# Altium project BoxCaptureZone_Hardware_V1_0_0.PrjPcb
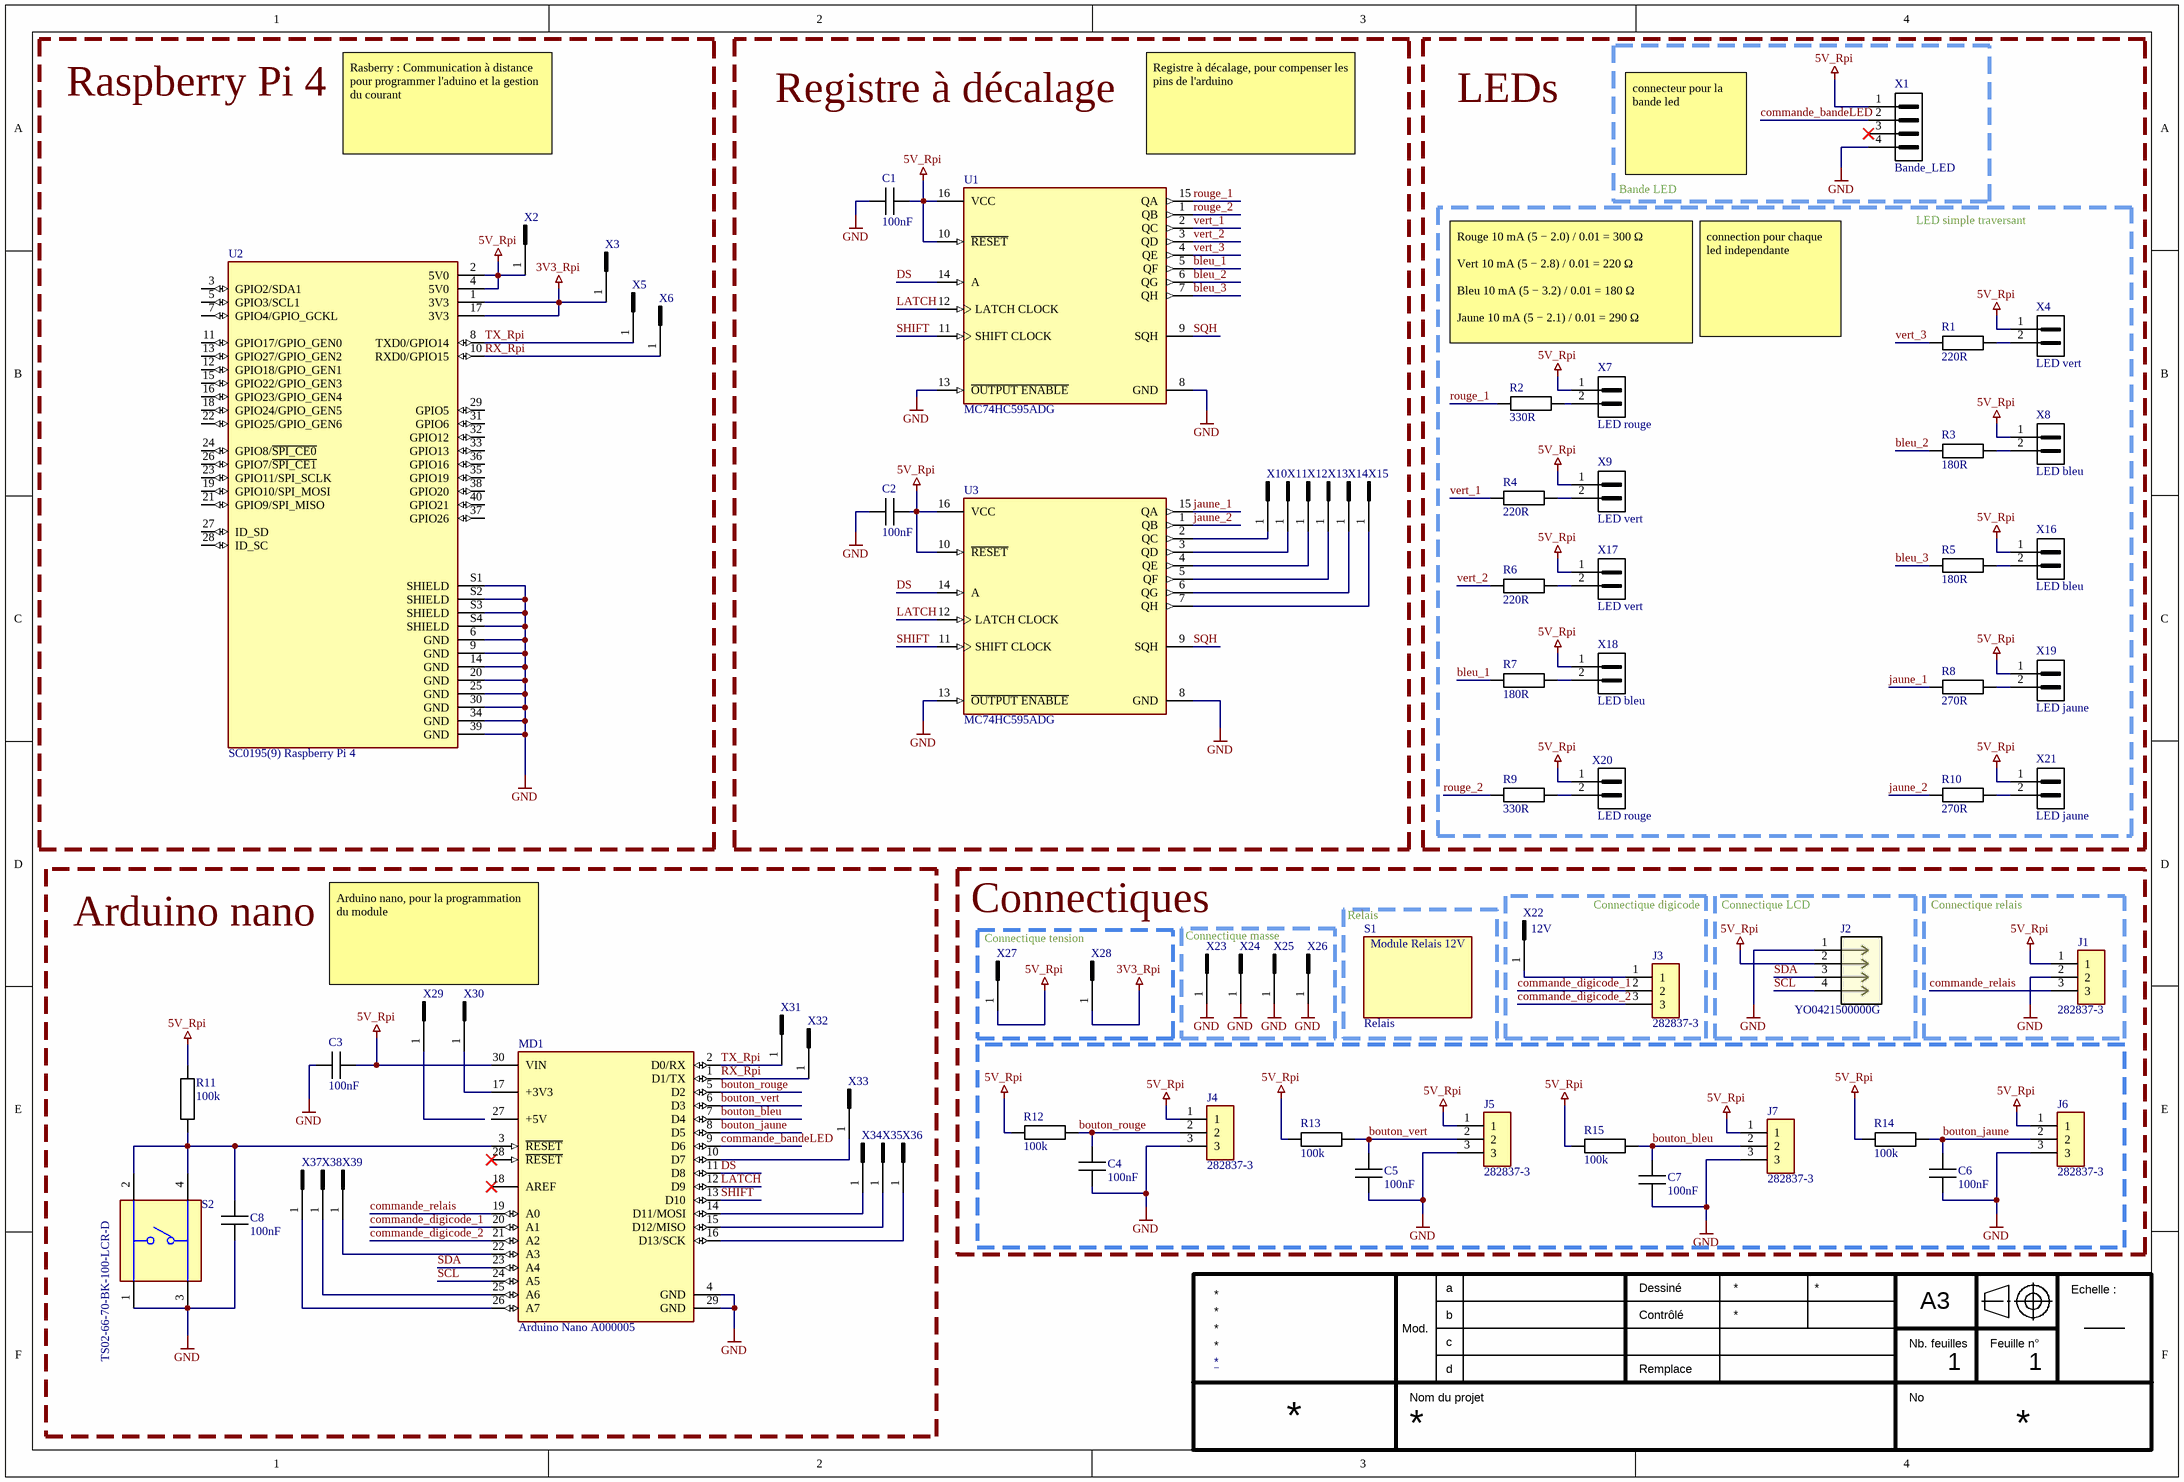
[diagram p0: ArduinoUno_Rpi.SchDoc]
1 sheet, 75 parts. Net scope: global (net labels, ports and power ports of the same name join across sheets).
Board file: PCB1.PcbDoc

## Sheet ArduinoUno_Rpi.SchDoc
size 408 x 276 mm; SheetNumber: 1; SheetTotal: 1

### Parts
C1  100nF  [CAPC2012X08M]
C2  100nF  [CAPC2012X08M]
C3  100nF  [CAPC2012X08M]
C4  100nF  [CAPC2012X08M]
C5  100nF  [CAPC2012X08M]
C6  100nF  [CAPC2012X08M]
C7  100nF  [CAPC2012X08M]
C8  100nF  [CAPC2012X08M]
J1  282837-3  [TE_282837-3]
J2  YO0421500000G  [CONN4_500000G_AMP]
J3  282837-3  [TE_282837-3]
J4  282837-3  [TE_282837-3]
J5  282837-3  [TE_282837-3]
J6  282837-3  [TE_282837-3]
J7  282837-3  [TE_282837-3]
MD1  Arduino Nano A000005  [FP-A000005-MFG]
R1  220R  [RESC1608X06M]
R2  330R  [RESC1608X06M]
R3  180R  [RESC1608X06M]
R4  220R  [RESC1608X06M]
R5  180R  [RESC1608X06M]
R6  220R  [RESC1608X06M]
R7  180R  [RESC1608X06M]
R8  270R  [RESC1608X06M]
R9  330R  [RESC1608X06M]
R10  270R  [RESC1608X06M]
R11  100k  [RESC2012X06M]
R12  100k  [RESC2012X06M]
R13  100k  [RESC2012X06M]
R14  100k  [RESC2012X06M]
R15  100k  [RESC2012X06M]
S1  Relais  [BOOSTER12V]
S2  TS02-66-70-BK-100-LCR-D  [SW_TS02-66-70-BK-100-LCR-D]
U1  MC74HC595ADG  [FP-751B-05-MFG]
U2  SC0195(9) Raspberry Pi 4  [MODULE_SC0195(9)]
U3  MC74HC595ADG  [FP-751B-05-MFG]
X1  Bande_LED  [PIN-1x04-2.54]
X2  2.54  [PIN-1x01-2.54]  (value not drawn)
X3  2.54  [PIN-1x01-2.54]  (value not drawn)
X4  LED vert  [PIN-1x02-2.54]
X5  2.54  [PIN-1x01-2.54]  (value not drawn)
X6  2.54  [PIN-1x01-2.54]  (value not drawn)
X7  LED rouge  [PIN-1x02-2.54]
X8  LED bleu  [PIN-1x02-2.54]
X9  LED vert  [PIN-1x02-2.54]
X10  2.54  [PIN-1x01-2.54]  (value not drawn)
X11  2.54  [PIN-1x01-2.54]  (value not drawn)
X12  2.54  [PIN-1x01-2.54]  (value not drawn)
X13  2.54  [PIN-1x01-2.54]  (value not drawn)
X14  2.54  [PIN-1x01-2.54]  (value not drawn)
X15  2.54  [PIN-1x01-2.54]  (value not drawn)
X16  LED bleu  [PIN-1x02-2.54]
X17  LED vert  [PIN-1x02-2.54]
X18  LED bleu  [PIN-1x02-2.54]
X19  LED jaune  [PIN-1x02-2.54]
X20  LED rouge  [PIN-1x02-2.54]
X21  LED jaune  [PIN-1x02-2.54]
X22  12V  [PIN-1x01-2.54]
X23  2.54  [PIN-1x01-2.54]  (value not drawn)
X24  2.54  [PIN-1x01-2.54]  (value not drawn)
X25  2.54  [PIN-1x01-2.54]  (value not drawn)
X26  2.54  [PIN-1x01-2.54]  (value not drawn)
X27  2.54  [PIN-1x01-2.54]  (value not drawn)
X28  2.54  [PIN-1x01-2.54]  (value not drawn)
X29  2.54  [PIN-1x01-2.54]  (value not drawn)
X30  2.54  [PIN-1x01-2.54]  (value not drawn)
X31  2.54  [PIN-1x01-2.54]  (value not drawn)
X32  2.54  [PIN-1x01-2.54]  (value not drawn)
X33  2.54  [PIN-1x01-2.54]  (value not drawn)
X34  2.54  [PIN-1x01-2.54]  (value not drawn)
X35  2.54  [PIN-1x01-2.54]  (value not drawn)
X36  2.54  [PIN-1x01-2.54]  (value not drawn)
X37  2.54  [PIN-1x01-2.54]  (value not drawn)
X38  2.54  [PIN-1x01-2.54]  (value not drawn)
X39  2.54  [PIN-1x01-2.54]  (value not drawn)

### Blocks framed on the sheet
Raspberry Pi 4: U2 X2 X3 X5 X6
Registre à décalage: C1 C2 U1 U3 X10-X15
Bande LED: X1
LED simple traversant: R1-R10 X4 X7-X9 X16-X21
Arduino nano: C3 C8 MD1 R11 S2 X29-X39
Connectiques: C4-C7 J4-J7 R12-R15
Connectique digicode: J3 X22
Connectique LCD: J2
Connectique relais: J1
Connectique tension: X27 X28
Connectique masse: X23-X26
Relais: S1

### Nets
3V3_Rpi: U2.1(3V3) U2.17(3V3) X3.1 X28.1
5V_Rpi: C1.1 C2.1 C3.1 J1.1 J2.2 J4.1 J5.1 J6.1 J7.1 MD1.30(VIN) R11.2 R12.2 R13.2 R14.2 R15.2 U1.10(~{RESET}) U1.16(VCC) U2.2(5V0) U2.4(5V0) U3.10(~{RESET}) U3.16(VCC) X1.1 X2.1 X4.1 X7.1 X8.1 X9.1 X16.1 X17.1 X18.1 X19.1 X20.1 X21.1 X27.1
GND: C1.2 C2.2 C3.2 C4.1 C5.1 C6.1 C7.1 C8.1 J1.2 J2.1 J4.3 J5.3 J6.3 J7.3 MD1.4(GND) MD1.29(GND) S2.1 S2.3 U1.8(GND) U1.13(~{OUTPUT_ENABLE}) U2.6(GND) U2.9(GND) U2.14(GND) U2.20(GND) U2.25(GND) U2.30(GND) U2.34(GND) U2.39(GND) U2.S1(SHIELD) U2.S2(SHIELD) U2.S3(SHIELD) U2.S4(SHIELD) U3.8(GND) U3.13(~{OUTPUT_ENABLE}) X1.4 X23.1 X24.1 X25.1 X26.1
bleu_1: R7.1 U1.5(QF)
bleu_2: R3.1 U1.6(QG)
bleu_3: R5.1 U1.7(QH)
bouton_bleu: C7.2 J7.2 MD1.7(D4) R15.1
bouton_jaune: C6.2 J6.2 MD1.8(D5) R14.1
bouton_rouge: C4.2 J4.2 MD1.5(D2) R12.1
bouton_vert: C5.2 J5.2 MD1.6(D3) R13.1
commande_bandeLED: MD1.9(D6) X1.2
commande_digicode_1: J3.2 MD1.20(A1)
commande_digicode_2: J3.3 MD1.21(A2)
commande_relais: J1.3 MD1.19(A0)
DS: MD1.11(D8) U1.14(A) U3.14(A)
jaune_1: R8.1 U3.15(QA)
jaune_2: R10.1 U3.1(QB)
LATCH: MD1.12(D9) U1.12(LATCH_CLOCK) U3.12(LATCH_CLOCK)
rouge_1: R2.1 U1.15(QA)
rouge_2: R9.1 U1.1(QB)
RX_Rpi: MD1.1(D1/TX) U2.10(RXD0/GPIO15) X6.1 X32.1
SCL: J2.4 MD1.24(A5)
SDA: J2.3 MD1.23(A4)
SHIFT: MD1.13(D10) U1.11(SHIFT_CLOCK) U3.11(SHIFT_CLOCK)
SQH: U1.9(SQH) U3.9(SQH)
TX_Rpi: MD1.2(D0/RX) U2.8(TXD0/GPIO14) X5.1 X31.1
vert_1: R4.1 U1.2(QC)
vert_2: R6.1 U1.3(QD)
vert_3: R1.1 U1.4(QE)
NetC8_2: C8.2 MD1.3(~{RESET}) R11.1 S2.2 S2.4
NetJ3_1: J3.1 X22.1
NetMD1_10: MD1.10(D7) X33.1
NetMD1_14: MD1.14(D11/MOSI) X34.1
NetMD1_15: MD1.15(D12/MISO) X35.1
NetMD1_16: MD1.16(D13/SCK) X36.1
NetMD1_17: MD1.17(+3V3) X30.1
NetMD1_22: MD1.22(A3) X39.1
NetMD1_25: MD1.25(A6) X38.1
NetMD1_26: MD1.26(A7) X37.1
NetR1_2: R1.2 X4.2
NetR2_2: R2.2 X7.2
NetR3_2: R3.2 X8.2
NetR4_2: R4.2 X9.2
NetR5_2: R5.2 X16.2
NetR6_2: R6.2 X17.2
NetR7_2: R7.2 X18.2
NetR8_2: R8.2 X19.2
NetR9_2: R9.2 X20.2
NetR10_2: R10.2 X21.2
NetU3_2: U3.2(QC) X10.1
NetU3_3: U3.3(QD) X11.1
NetU3_4: U3.4(QE) X12.1
NetU3_5: U3.5(QF) X13.1
NetU3_6: U3.6(QG) X14.1
NetU3_7: U3.7(QH) X15.1

Not connected (* = marked no-connect by the designer): MD1 18(AREF)* 27(+5V) 28(~{RESET})*; U2 3(GPIO2/SDA1) 5(GPIO3/SCL1) 7(GPIO4/GPIO_GCKL) 11(GPIO17/GPIO_GEN0) 12(GPIO18/GPIO_GEN1) 13(GPIO27/GPIO_GEN2) 15(GPIO22/GPIO_GEN3) 16(GPIO23/GPIO_GEN4) 18(GPIO24/GPIO_GEN5) 19(GPIO10/SPI_MOSI) 21(GPIO9/SPI_MISO) 22(GPIO25/GPIO_GEN6) 23(GPIO11/SPI_SCLK) 24(GPIO8/~{SPI_CE0}) 26(GPIO7/~{SPI_CE1}) 27(ID_SD) 28(ID_SC) 29(GPIO5) 31(GPIO6) 32(GPIO12) 33(GPIO13) 35(GPIO19) 36(GPIO16) 37(GPIO26) 38(GPIO20) 40(GPIO21); X1 3*; X29 1

### Notes on the sheet
- Rasberry : Communication à distance pour programmer l'aduino et la gestion du courant
- (near U1) Registre à décalage, pour compenser les pins de l'arduino
- LEDs
- connecteur pour la bande led
- Rouge	10 mA	(5 − 2.0) / 0.01 = 300 Ω
  Vert	10 mA	(5 − 2.8) / 0.01 = 220 Ω
  Bleu	10 mA	(5 − 3.2) / 0.01 = 180 Ω
  Jaune	10 mA	(5 − 2.1) / 0.01 = 290 Ω
- connection pour chaque led independante
- Arduino nano, pour la programmation du module
- a
- Dessiné
- A3
- Echelle :
- Mod.
- b
- c
- d
- Contrôlé
- Remplace
- Nb. feuilles
- Feuille n°
- Nom du projet
- No
- (in symbol Relais) Module Relais 12V

### Library data of the parts
C1-C8 = CMP-065-000038-2: CAPC 100nF X7R 50V 10% 2012 (0805 INCH); Manufacturer Number: C2012X7R1H104K085AA; Manufacturer: TDK; IsStocked: 1; TemperatureRange: -55°C to +125°C; PN: PN-747862; Supplier Part Number 1: FAB.0805_C 100n; Supplier Price 1: 0.0200; Voltage: 50V; Dielectric: X7R; Value: 100nF; SubCategory: Condensateurs ceramique; Category: Passives; Tolerance: ±10%; Supplier 1: ETML
J1 J3-J7 = 282837-3: TERMI-BLOK PCB MOUNT 3P; Availability: Unavailable; Package: None; MP: 282837-3; Value: *; Price: None
J2 = YO0421500000G: No Description Available; Manufacturer_Name: Amphenol ICC; Copyright: Copyright (C) 2025 Ultra Librarian. All rights reserved.; Manufacturer_Part_Number: YO0421500000G; RefDes: RefDes; Type: Type
MD1 = CMP-189986-000002-1: ARDUINO NANO ATMEGA328 EVAL BRD; Number of Bits: 8; Evaluation Kit: Yes; Operating Supply Voltage: 12V; Interface: I2C; Data Bus Width: 8b; Core Architecture: AVR; Packaging: Bulk; Length: 7inch; Package Quantity: 50; Width: 5inch; REACH SVHC: No SVHC; Weight: 0.358383oz; Series: AVR® ATmega; Height: 0.25inch
R1 R4 R6 = CMP-066-000104-2: RES 220ohm  ±1% 0.1W  1608 (0603 INCH); Manufacturer Number: RC0603FR-07220RL; Manufacturer: Yageo; Voltage: 75V; Value: 220; TemperatureRange: -55°C to 155°C; PN: PN-315954; TemperatureCoeff: ±100ppm/°C; IsStocked: 1; Supplier 1: ETML; Power: 0.1W; SubCategory: Resistances couche epaisse; Supplier Price 1: 0.0200; Category: Passives; Tolerance: ±1%; Supplier Part Number 1: FAB.0603_R 220R
R2 R9 = CMP-066-000106-2: RES 330ohm  ±1% 0.1W  1608 (0603 INCH); Manufacturer: Yageo; Manufacturer Number: RC0603FR-07330RL; PN: PN-554037; Voltage: 75V; Value: 330; TemperatureRange: -55°C to 155°C; TemperatureCoeff: ±100ppm/°C; IsStocked: 1; SubCategory: Resistances couche epaisse; Tolerance: ±1%; Supplier Price 1: 0.0200; Category: Passives; Power: 0.1W; Supplier Part Number 1: FAB.0603_R 330R; Supplier 1: ETML
R3 R5 R7 = CMP-066-000103-2: RES 180ohm  ±1% 0.1W  1608 (0603 INCH); Manufacturer Number: RC0603FR-07180RL; Manufacturer: Yageo; TemperatureRange: -55°C to 155°C; PN: PN-646912; IsStocked: 1; Voltage: 75V; TemperatureCoeff: ±100ppm/°C; Value: 180; Supplier 1: ETML; Category: Passives; Supplier Price 1: 0.0200; Tolerance: ±1%; Power: 0.1W; SubCategory: Resistances couche epaisse; Supplier Part Number 1: FAB.0603_R 180R
R8 R10 = CMP-066-000105-2: RES 270ohm  ±1% 0.1W  1608 (0603 INCH); Manufacturer: Yageo; Manufacturer Number: RC0603FR-07270RL; TemperatureCoeff: ±100ppm/°C; TemperatureRange: -55°C to 155°C; Voltage: 75V; Value: 270; PN: PN-884995; IsStocked: 1; Category: Passives; Supplier Part Number 1: FAB.0603_R 270R; Tolerance: ±1%; Supplier 1: ETML; Power: 0.1W; SubCategory: Resistances couche epaisse; Supplier Price 1: 0.0200
R11-R15 = CMP-066-000211-2: RES 100kohm  ±1% 0.125W 2012 (0805 INCH); Manufacturer: Yageo; Manufacturer Number: RC0805FR-07100KL; TemperatureCoeff: ±200ppm/°C; Voltage: 150V; TemperatureRange: -55°C to 155°C; IsStocked: 1; PN: PN-903408; Category: Passives; Supplier Part Number 1: FAB.0805_R 100k; Value: 100k; Tolerance: ±1%; Supplier Price 1: 0.0200; Power: 0.125W; SubCategory: Resistances couche epaisse; Supplier 1: ETML
S1 = Relais: 6 x 6 mm, 7 mm Actuator Height, 100 gf, Black, Long Crimped, Through Hole, SPST, Tactile Switch; MF: Same Sky; MP: TS02-66-70-BK-100-LCR-D; SnapEDA_Link: https://www.snapeda.com/parts/TS02-66-70-BK-100-LCR-D/Same+Sky/view-part/?ref=snap; Package: None; Value: *; Check_prices: https://www.snapeda.com/parts/TS02-66-70-BK-100-LCR-D/Same+Sky/view-part/?ref=eda
S2 = TS02-66-70-BK-100-LCR-D: 6 x 6 mm, 7 mm Actuator Height, 100 gf, Black, Long Crimped, Through Hole, SPST, Tactile Switch; MF: Same Sky; SnapEDA_Link: https://www.snapeda.com/parts/TS02-66-70-BK-100-LCR-D/Same+Sky/view-part/?ref=snap; Package: None; Value: *; MP: TS02-66-70-BK-100-LCR-D; Check_prices: https://www.snapeda.com/parts/TS02-66-70-BK-100-LCR-D/Same+Sky/view-part/?ref=eda; Supplier 1: DigiKey; Supplier Part Number 1: 2223-TS02-66-70-BK-100-LCR-D-ND
U1 U3 = CMP-07113-000001-1: IC SHIFT REGISTER 8BIT 16-SOIC; Manufacturer: On Semiconductor; Number Of Inputs: 1; Logic Function Desc: Non-Inverting; Min Supply Voltage: 2V; Standoff Height: 0.1mm; Frequency: 35MHz; Propagation Delay: 38ns; Max Supply Voltage: 6V; Quiescent Current: 4-160uA; Number Of Outputs: 9; Lead Free: Yes; ComponentLink2URL: https://www.onsemi.com/pub/Collateral/MC74HC595A-D.PDF; Digikey Description: IC SHIFT REGISTER 8BIT 16-SOIC; Category: IC; Package: 751B-05; Number Of Circuits: 1; ComponentLink2Description: Datasheet; Automotive: No; Mouser Description: Shift Register Single 8-Bit Serial to Serial/Parallel Automotive 16-Pin SOIC Tube; Temperature: -55°C to +125°C; Height: 1.75mm; Ambient Temperature Range Low: -55°C; Ambient Temperature Range High: +125°C; Octopart: https://octopart.com/mc74hc595adg-on+semiconductor-127876; Temperature Range Low: -55°C; Device Class L1: Integrated Circuits (ICs); Ipc Land Pattern Name: SOIC127P600X155-16; Device Class L3: Latches and Flip Flops; Temperature Range High: +125°C; Device Class L2: Logic ICs; Footprint Url: https://www.onsemi.com/pub/Collateral/751B-05.PDF; RoHS: TRUE; Manufacturer Part Number: MC74HC595ADG
U2 = SC0195(9): The Raspberry Pi 4 Model B SC0195-9 single board computer features a powerful Broadcom BCM2711 ARM Cortex-A72 processor with 1.5GHz speed and four cores, making it ideal for demanding embedded computing applications. With 8GB of RAM and a compact size of; SnapEDA_Link: https://www.snapeda.com/parts/SC0195(9)/Raspberry+Pi/view-part/?ref=snap; Package: None; Value: *; MF: Raspberry Pi; MP: SC0195(9); Check_prices: https://www.snapeda.com/parts/SC0195(9)/Raspberry+Pi/view-part/?ref=eda; Supplier 1: DigiKey; Supplier Part Number 1: 2648-SC0195(9)-ND
X1 = CMP-055-000000-1: PIN HEADER 2.54 1x04; Manufacturer: Würth Electronik; Manufacturer Number: 61300411121; IsStocked: True; Value: 2.54; Current: 3A; PN: PN-579072; Voltage: 250V; TemperatureRange: -40°C to +105°C; Supplier Price 1: 0.08; Supplier 1: ETML; Supplier Part Number 1: MAG.283.897; Category: Connectors; SubCategory: Pin Header
X2 X3 X5 X6 X10-X15 X23-X39 = CMP-055-000009-1: PIN HEADER 2.54 1x01; Manufacturer: Würth Electronik; Manufacturer Number: 61300211121; IsStocked: True; Voltage: 250V; Current: 3A; TemperatureRange: -40°C to +105°C; PN: PN-585694; Category: Connectors; SubCategory: Pin Header; Value: 2.54
X4 X7-X9 X16-X21 = CMP-055-000006-1: PIN HEADER 2.54 1x02; Manufacturer Number: 61300211121; Manufacturer: Würth Electronik; IsStocked: True; PN: PN-573903; Voltage: 250V; Current: 3A; TemperatureRange: -40°C to +105°C; Value: 2.54; Supplier Part Number 1: MAG.283.897; Supplier Price 1: 0.04; Supplier 1: ETML; SubCategory: Pin Header; Category: Connectors
X22 = CMP-055-000009-1: PIN HEADER 2.54 1x01; Manufacturer: Würth Electronik; Manufacturer Number: 61300211121; IsStocked: True; Voltage: 250V; Current: 3A; TemperatureRange: -40°C to +105°C; PN: PN-585694; Value: 2.54; Category: Connectors; SubCategory: Pin Header